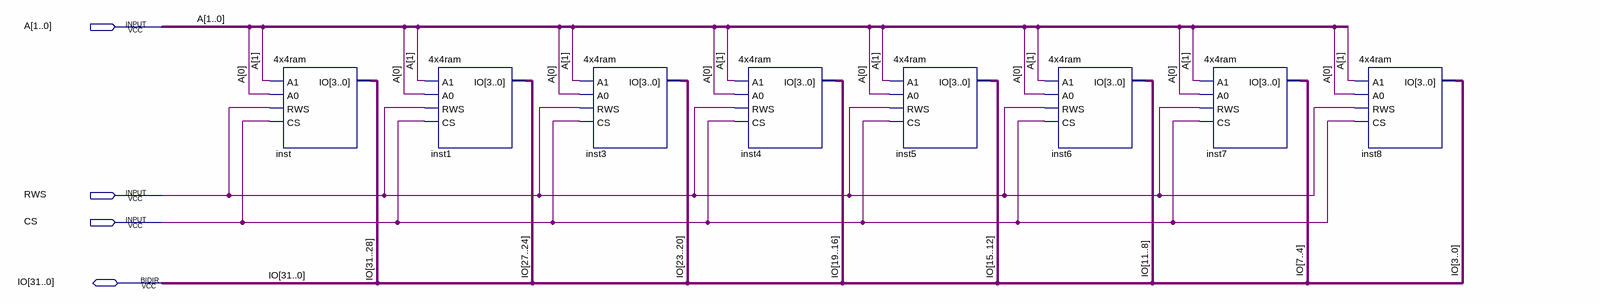
[diagram p0: schematic sheet]
// Quartus schematic 4x32ram.bdf as structural Verilog: 8 symbols, 4 pins
module \4x32ram  (
  input  [1:0] A,
  input  RWS,
  input  CS,
  inout  [31:0] IO
);

  \4x4ram  inst (.A1(A[1]), .A0(A[0]), .RWS(RWS), .CS(CS), .IO(IO[31:28]));
  \4x4ram  inst1 (.A1(A[1]), .A0(A[0]), .RWS(RWS), .CS(CS), .IO(IO[27:24]));
  \4x4ram  inst3 (.A1(A[1]), .A0(A[0]), .RWS(RWS), .CS(CS), .IO(IO[23:20]));
  \4x4ram  inst4 (.A1(A[1]), .A0(A[0]), .RWS(RWS), .CS(CS), .IO(IO[19:16]));
  \4x4ram  inst5 (.A1(A[1]), .A0(A[0]), .RWS(RWS), .CS(CS), .IO(IO[15:12]));
  \4x4ram  inst6 (.A1(A[1]), .A0(A[0]), .RWS(RWS), .CS(CS), .IO(IO[11:8]));
  \4x4ram  inst7 (.A1(A[1]), .A0(A[0]), .RWS(RWS), .CS(CS), .IO(IO[7:4]));
  \4x4ram  inst8 (.A1(A[1]), .A0(A[0]), .RWS(RWS), .CS(CS), .IO(IO[3:0]));
endmodule
